# EAGLE schematic audio-board (EAGLE 7.5.0)
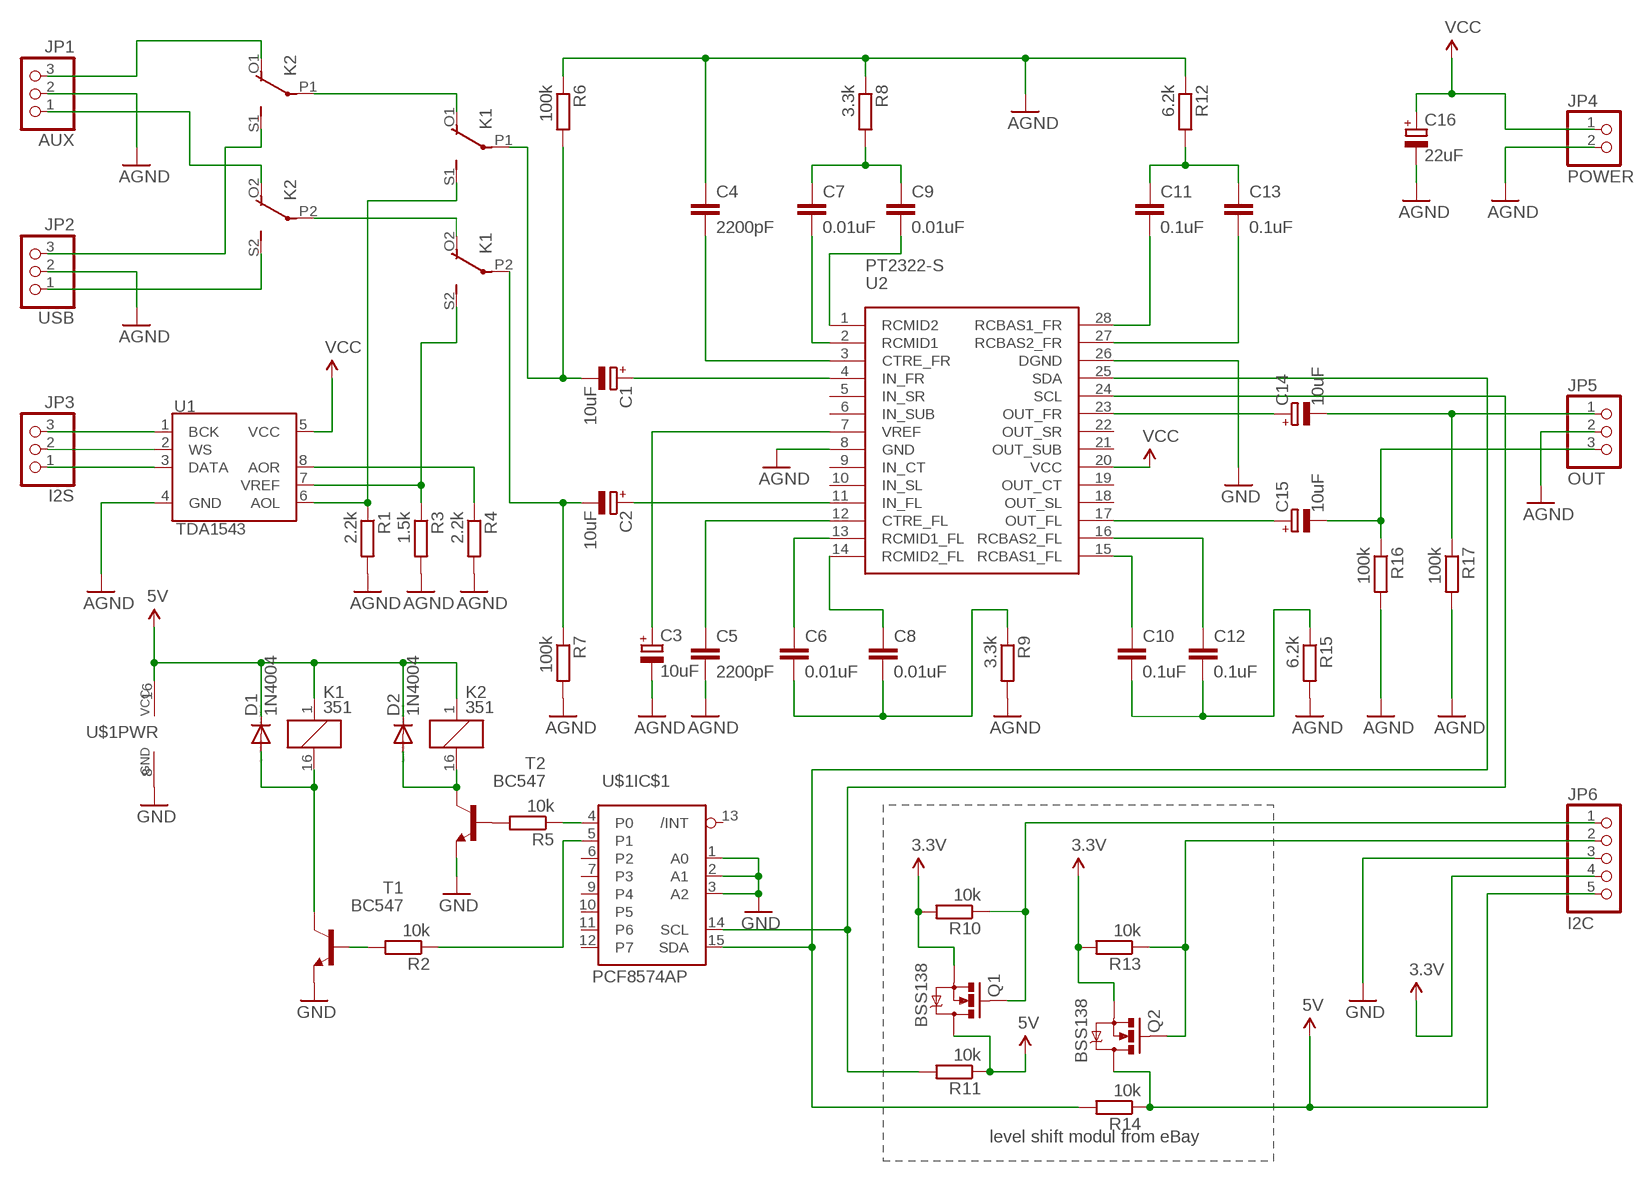
[diagram p0: schematic, sheet 1]

## Parts
AUX  JP1  PINHD-1X3  [1X03]
C1  10uF  CPOL-EUE2-5  [E2-5]
C2  10uF  CPOL-EUE2-5  [E2-5]
C3  10uF  CPOL-EUE2-5  [E2-5]
C4  2200pF  C-EU025-025X050  [C025-025X050]
C5  2200pF  C-EU025-025X050  [C025-025X050]
C6  0.01uF  C-EU025-025X050  [C025-025X050]
C7  0.01uF  C-EU025-025X050  [C025-025X050]
C8  0.01uF  C-EU025-025X050  [C025-025X050]
C9  0.01uF  C-EU025-025X050  [C025-025X050]
C10  0.1uF  C-EU025-025X050  [C025-025X050]
C11  0.1uF  C-EU025-025X050  [C025-025X050]
C12  0.1uF  C-EU025-025X050  [C025-025X050]
C13  0.1uF  C-EU025-025X050  [C025-025X050]
C14  10uF  CPOL-EUE2-5  [E2-5]
C15  10uF  CPOL-EUE2-5  [E2-5]
C16  22uF  CPOL-EUE2.5-7  [E2,5-7]
D1  1N4004  [DO41-10]
D2  1N4004  [DO41-10]
I2S  JP3  PINHD-1X3  [1X03]
JP4  POWER  PINHD-1X2  [1X02]
JP5  OUT  PINHD-1X3  [1X03]
JP6  I2C  PINHD-1X5  [1X05]
K1  351  [351]
K2  351  [351]
Q1  BSS138  MOSFET-NCHANNELSMD  [SOT23-3]
Q2  BSS138  MOSFET-NCHANNELSMD  [SOT23-3]
R1  2.2k  R-EU_0207/10  [0207/10]
R2  10k  R-EU_0207/10  [0207/10]
R3  1.5k  R-EU_0207/10  [0207/10]
R4  2.2k  R-EU_0207/10  [0207/10]
R5  10k  R-EU_0207/10  [0207/10]
R6  100k  R-EU_0207/10  [0207/10]
R7  100k  R-EU_0207/10  [0207/10]
R8  3.3k  R-EU_0207/10  [0207/10]
R9  3.3k  R-EU_0207/10  [0207/10]
R10  10k  R-EU_0207/10  [0207/10]
R11  10k  R-EU_0207/10  [0207/10]
R12  6.2k  R-EU_0207/10  [0207/10]
R13  10k  R-EU_0207/10  [0207/10]
R14  10k  R-EU_0207/10  [0207/10]
R15  6.2k  R-EU_0207/10  [0207/10]
R16  100k  R-EU_0207/10  [0207/10]
R17  100k  R-EU_0207/10  [0207/10]
T1  BC547  [TO92]
T2  BC547  [TO92]
U1  TDA1543  [DIL8]
U2  PT2322-S  [SOP28]
U$1  PCF8574AP  [DIL16]
USB  JP2  PINHD-1X3  [1X03]

## Nets
3.3V: JP6.4 Q1.2(S) Q2.2(S) R10.2 R13.2
5V: D1.C D2.C JP6.5 K1.1 K2.1 Q1.3(D) Q2.3(D) R11.1 R14.1 U$1.16(PWR:VCC)
AGND: AUX.2 C3.- C4.1 C5.2 C16.- JP4.2 JP5.2 R1.2 R3.2 R4.2 R6.1 R7.2 R8.1 R9.2 R12.1 R15.2 R16.2 R17.2 U1.4(GND) U2.8(GND) USB.2
GND: JP6.3 T1.1(E) T2.1(E) U2.26(DGND) U$1.1(IC$1:A0) U$1.2(IC$1:A1) U$1.3(IC$1:A2) U$1.8(PWR:GND)
N$1: C1.+ U2.4(IN_FR)
N$2: C2.+ U2.11(IN_FL)
N$3: C1.- K1.P1(2:P) R6.2
N$4: C2.- K1.P2(3:P) R7.1
N$5: C3.+ U2.7(VREF)
N$6: C5.1 U2.12(CTRE_FL)
N$7: C6.1 U2.13(RCMID1_FL)
N$8: C8.1 U2.14(RCMID2_FL)
N$9: C10.2 C12.2 R15.1
N$10: C12.1 U2.16(RCBAS2_FL)
N$11: C10.1 U2.15(RCBAS1_FL)
N$12: K1.O1(2:O) K2.P1(2:P)
N$13: C9.2 U2.1(RCMID2)
N$14: C7.2 U2.2(RCMID1)
N$15: C4.2 U2.3(CTRE_FR)
N$16: C7.1 C9.1 R8.2
N$17: AUX.3 K2.O1(2:O)
N$18: C11.2 U2.28(RCBAS1_FR)
N$19: C13.2 U2.27(RCBAS2_FR)
N$20: C11.1 C13.1 R12.2
N$21: C14.+ U2.23(OUT_FR)
N$22: C15.+ U2.17(OUT_FL)
N$23: C14.- JP5.1 R17.1
N$24: C15.- JP5.3 R16.1
N$25: AUX.1 K2.O2(3:O)
N$26: K2.S1(2:S) USB.3
N$27: K2.S2(3:S) USB.1
N$28: I2S.3 U1.1(BCK)
N$29: I2S.2 U1.2(WS)
N$30: I2S.1 U1.3(DATA)
N$31: K1.O2(3:O) K2.P2(3:P)
N$32: D1.A K1.16 T1.3(C)
N$33: R4.1 U1.8(AOR)
N$34: C6.2 C8.2 R9.1
N$35: K1.S1(2:S) R1.1 U1.6(AOL)
N$36: K1.S2(3:S) R3.1 U1.7(VREF)
N$37: D2.A K2.16 T2.3(C)
N$39: R5.2 T2.2(B)
N$40: R2.2 T1.2(B)
N$41: R11.2 U2.24(SCL) U$1.14(IC$1:SCL)
N$42: R14.2 U2.25(SDA) U$1.15(IC$1:SDA)
N$47: JP6.2 Q2.1(G) R13.1
N$48: JP6.1 Q1.1(G) R10.1
U2: R5.1 U$1.4(IC$1:P0)
U3: R2.1 U$1.5(IC$1:P1)
VCC: C16.+ JP4.1 U1.5(VCC) U2.20(VCC)
Unconnected: U2.5(IN_SR) U2.6(IN_SUB) U2.9(IN_CT) U2.10(IN_SL) U2.18(OUT_SL) U2.19(OUT_CT) U2.21(OUT_SUB) U2.22(OUT_SR) U$1.6(IC$1:P2) U$1.7(IC$1:P3) U$1.9(IC$1:P4) U$1.10(IC$1:P5) U$1.11(IC$1:P6) U$1.12(IC$1:P7) U$1.13(IC$1:/INT)

## Notes on the sheet
- level shift modul from eBay

## Library data of the parts
AUX I2S JP5 USB = pinhead:PINHD-1X3: PIN HEADER
C1-C3 C14-C16 = rcl:CPOL-EU: POLARIZED CAPACITOR, European symbol
C4-C13 = rcl:C-EU: CAPACITOR, European symbol
D1 D2 = diode:1N4004: DIODE general purpose rectifier, 1 A
JP4 = pinhead:PINHD-1X2: PIN HEADER
JP6 = pinhead:PINHD-1X5: PIN HEADER
K1 K2 = relay:351: RELAY 2 x switch, Omron; OC_FARNELL: unknown; OC_NEWARK: unknown
Q1 Q2 = SparkFun:MOSFET-NCHANNEL
R1-R17 = rcl:R-EU_: RESISTOR, European symbol
T1 T2 = transistor-neu-to92:BC547: NPN TRANSISTOR
U1 = Miszczo:TDA1543
U2 = pt2322:PT2322-S
U$1 = i2c:PCF8574: Remote 8-Bit I/O Expander for I²C Bus